# Altium schematic sheet EIS_Main_Radio.SchDoc: EIS: Funk-Anbindung
size A4; FaxNumber: +49 7721 943 210; Organization: Hahn-Schickard; Address1: Wilhelm-Schickard-Str. 10; Address2: 78052 Villingen-Schwenningen; Address3: Bernd.Ehrbrecht@Hahn-Schickard.de; DocumentNumber: 1; Revision: 1.0; SheetNumber: 5; SheetTotal: 7; PhoneNumber: 0 7721 943 137; E-Mail: Xxxx.Xxxx@Hahn-Schickard.de; ProjectName: Project File Name
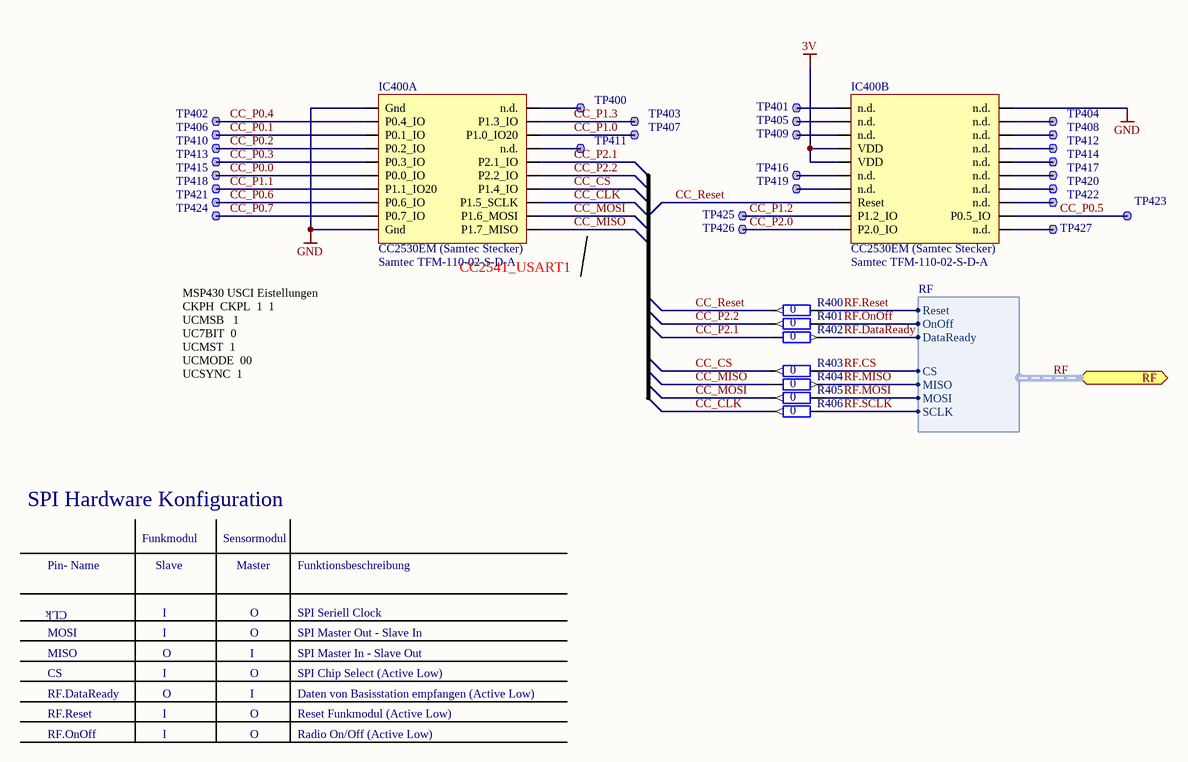
[diagram p0: EIS_Main_Radio.SchDoc]

## Parts
IC400  CC2530EM (Samtec Stecker)  01_Hersteller: Samtec TFM-110-02-S-D-A  [CC2400EM_Board]  (parts A,B of 2)
R400  0  [RESC1608N]
R401  0  [RESC1608N]
R402  0  [RESC1608N]
R403  0  [RESC1608N]
R404  0  [RESC1608N]
R405  0  [RESC1608N]
R406  0  [RESC1608N]
TP400  Testpoint 1mm  [Testpoint 1mm]  (value not drawn)  (no BOM)
TP401  Testpoint 1mm  [Testpoint 1mm]  (value not drawn)  (no BOM)
TP402  Testpoint 1mm  [Testpoint 1mm]  (value not drawn)  (no BOM)
TP403  Testpoint 1mm  [Testpoint 1mm]  (value not drawn)  (no BOM)
TP404  Testpoint 1mm  [Testpoint 1mm]  (value not drawn)  (no BOM)
TP405  Testpoint 1mm  [Testpoint 1mm]  (value not drawn)  (no BOM)
TP406  Testpoint 1mm  [Testpoint 1mm]  (value not drawn)  (no BOM)
TP407  Testpoint 1mm  [Testpoint 1mm]  (value not drawn)  (no BOM)
TP408  Testpoint 1mm  [Testpoint 1mm]  (value not drawn)  (no BOM)
TP409  Testpoint 1mm  [Testpoint 1mm]  (value not drawn)  (no BOM)
TP410  Testpoint 1mm  [Testpoint 1mm]  (value not drawn)  (no BOM)
TP411  Testpoint 1mm  [Testpoint 1mm]  (value not drawn)  (no BOM)
TP412  Testpoint 1mm  [Testpoint 1mm]  (value not drawn)  (no BOM)
TP413  Testpoint 1mm  [Testpoint 1mm]  (value not drawn)  (no BOM)
TP414  Testpoint 1mm  [Testpoint 1mm]  (value not drawn)  (no BOM)
TP415  Testpoint 1mm  [Testpoint 1mm]  (value not drawn)  (no BOM)
TP416  Testpoint 1mm  [Testpoint 1mm]  (value not drawn)  (no BOM)
TP417  Testpoint 1mm  [Testpoint 1mm]  (value not drawn)  (no BOM)
TP418  Testpoint 1mm  [Testpoint 1mm]  (value not drawn)  (no BOM)
TP419  Testpoint 1mm  [Testpoint 1mm]  (value not drawn)  (no BOM)
TP420  Testpoint 1mm  [Testpoint 1mm]  (value not drawn)  (no BOM)
TP421  Testpoint 1mm  [Testpoint 1mm]  (value not drawn)  (no BOM)
TP422  Testpoint 1mm  [Testpoint 1mm]  (value not drawn)  (no BOM)
TP423  Testpoint 1mm  [Testpoint 1mm]  (value not drawn)  (no BOM)
TP424  Testpoint 1mm  [Testpoint 1mm]  (value not drawn)  (no BOM)
TP425  Testpoint 1mm  [Testpoint 1mm]  (value not drawn)  (no BOM)
TP426  Testpoint 1mm  [Testpoint 1mm]  (value not drawn)  (no BOM)
TP427  Testpoint 1mm  [Testpoint 1mm]  (value not drawn)  (no BOM)

## Ports
RF (harness RF)

## Harnesses
RF: SCLK, MOSI, MISO, CS, DataReady, OnOff, Reset

## Nets
3V: IC400.P2_7(VDD) IC400.P2_9(VDD)
GND: IC400.P1_1(Gnd) IC400.P1_19(Gnd) IC400.P2_2(n.d.)
CC_CLK: IC400.P1_16(P1.5_SCLK) R406.1
CC_CS: IC400.P1_14(P1.4_IO) R403.1
CC_MISO: IC400.P1_20(P1.7_MISO) R404.1
CC_MOSI: IC400.P1_18(P1.6_MOSI) R405.1
CC_P0.0: IC400.P1_11(P0.0_IO) TP415.1
CC_P0.1: IC400.P1_5(P0.1_IO) TP406.1
CC_P0.2: IC400.P1_7(P0.2_IO) TP410.1
CC_P0.3: IC400.P1_9(P0.3_IO) TP413.1
CC_P0.4: IC400.P1_3(P0.4_IO) TP402.1
CC_P0.5: IC400.P2_18(P0.5_IO) TP423.1
CC_P0.6: IC400.P1_15(P0.6_IO) TP421.1
CC_P0.7: IC400.P1_17(P0.7_IO) TP424.1
CC_P1.0: IC400.P1_6(P1.0_IO20) TP407.1
CC_P1.1: IC400.P1_13(P1.1_IO20) TP418.1
CC_P1.2: IC400.P2_17(P1.2_IO) TP425.1
CC_P1.3: IC400.P1_4(P1.3_IO) TP403.1
CC_P2.0: IC400.P2_19(P2.0_IO) TP426.1
CC_P2.1: IC400.P1_10(P2.1_IO) R402.1
CC_P2.2: IC400.P1_12(P2.2_IO) R401.1
CC_Reset: IC400.P2_15(Reset) R400.1
RF.CS: R403.2 ; port RF.CS
RF.DataReady: R402.2 ; port RF.DataReady
RF.MISO: R404.2 ; port RF.MISO
RF.MOSI: R405.2 ; port RF.MOSI
RF.OnOff: R401.2 ; port RF.OnOff
RF.Reset: R400.2 ; port RF.Reset
RF.SCLK: R406.2 ; port RF.SCLK
NetIC400_P1_2: IC400.P1_2(n.d.) TP400.1
NetIC400_P1_8: IC400.P1_8(n.d.) TP411.1
NetIC400_P2_1: IC400.P2_1(n.d.) TP401.1
NetIC400_P2_3: IC400.P2_3(n.d.) TP405.1
NetIC400_P2_4: IC400.P2_4(n.d.) TP404.1
NetIC400_P2_5: IC400.P2_5(n.d.) TP409.1
NetIC400_P2_6: IC400.P2_6(n.d.) TP408.1
NetIC400_P2_8: IC400.P2_8(n.d.) TP412.1
NetIC400_P2_10: IC400.P2_10(n.d.) TP414.1
NetIC400_P2_11: IC400.P2_11(n.d.) TP416.1
NetIC400_P2_12: IC400.P2_12(n.d.) TP417.1
NetIC400_P2_13: IC400.P2_13(n.d.) TP419.1
NetIC400_P2_14: IC400.P2_14(n.d.) TP420.1
NetIC400_P2_16: IC400.P2_16(n.d.) TP422.1
NetIC400_P2_20: IC400.P2_20(n.d.) TP427.1

## Buses and harness runs
harness RF = port RF

## Notes on the sheet
- (near IC400) CC2541_USART1
- MSP430 USCI Eistellungen
  CKPH  CKPL 	1  1
  UCMSB 		1
  UC7BIT		0
  UCMST		1
  UCMODE		00
  UCSYNC		1
- SPI Hardware Konfiguration
- Pin- Name
- Funkmodul
- Slave
- Sensormodul
- Master
- Funktionsbeschreibung
- MOSI
- CLk
- I
- O
- SPI Seriell Clock
- SPI Master Out - Slave In
- MISO
- CS
- RF.DataReady
- RF.Reset
- SPI Chip Select (Active Low)
- Reset Funkmodul (Active Low)
- Daten von Basisstation empfangen (Active Low)
- SPI Master In - Slave Out
- RF.OnOff
- Radio On/Off (Active Low)
- Project Name:
- Size:
- Date:
- Title:
- A4
- Time:
- Revision:
- Sheet
- of
- File:

## Library data of the parts
IC400 = CC2530EM: CC2530EM Referenzdesign, Samtec TFM-110-02-S-D-A; 05_Datasheet_Link_Lokal: O:\Altium Designer\Datasheets\Texas Instruments\CC2400EVA; 09_Ersteller: HSG Rachid Nouna; 02_Herstellerbezeichnung: ka; 03_Hersteller_Link: http://www.ti.com; 04_Datasheet_Link: Datasheet; 06 Footprint_Link_Lokal: O:\Altium Designer\Datasheets\Texas Instruments\CC2400EVA; 10_Erstell_Datum: 21.9.2009; 07_Lieferant: Samtec; 08_Lieferanten_Nummer: TFM-110-02-S-D-A
R400-R406 = RESC1608 (R0603): 07_Lieferant: Farnell; 08_Lieferanten_Nummer: 2059527; Supplier 1: Farnell; Supplier Part Number 1: 2008343
TP400-TP427 = Tespoint 1mm